# Altium schematic sheet connectors_org.SchDoc: foxBMS BMS-Slave 12-Cell
size A3; DocumentNumber: 6; SheetNumber: 6; SheetTotal: 11; AUTHOR: Fraunhofer IISB foxBMS Team; SheetDescription: Connectors
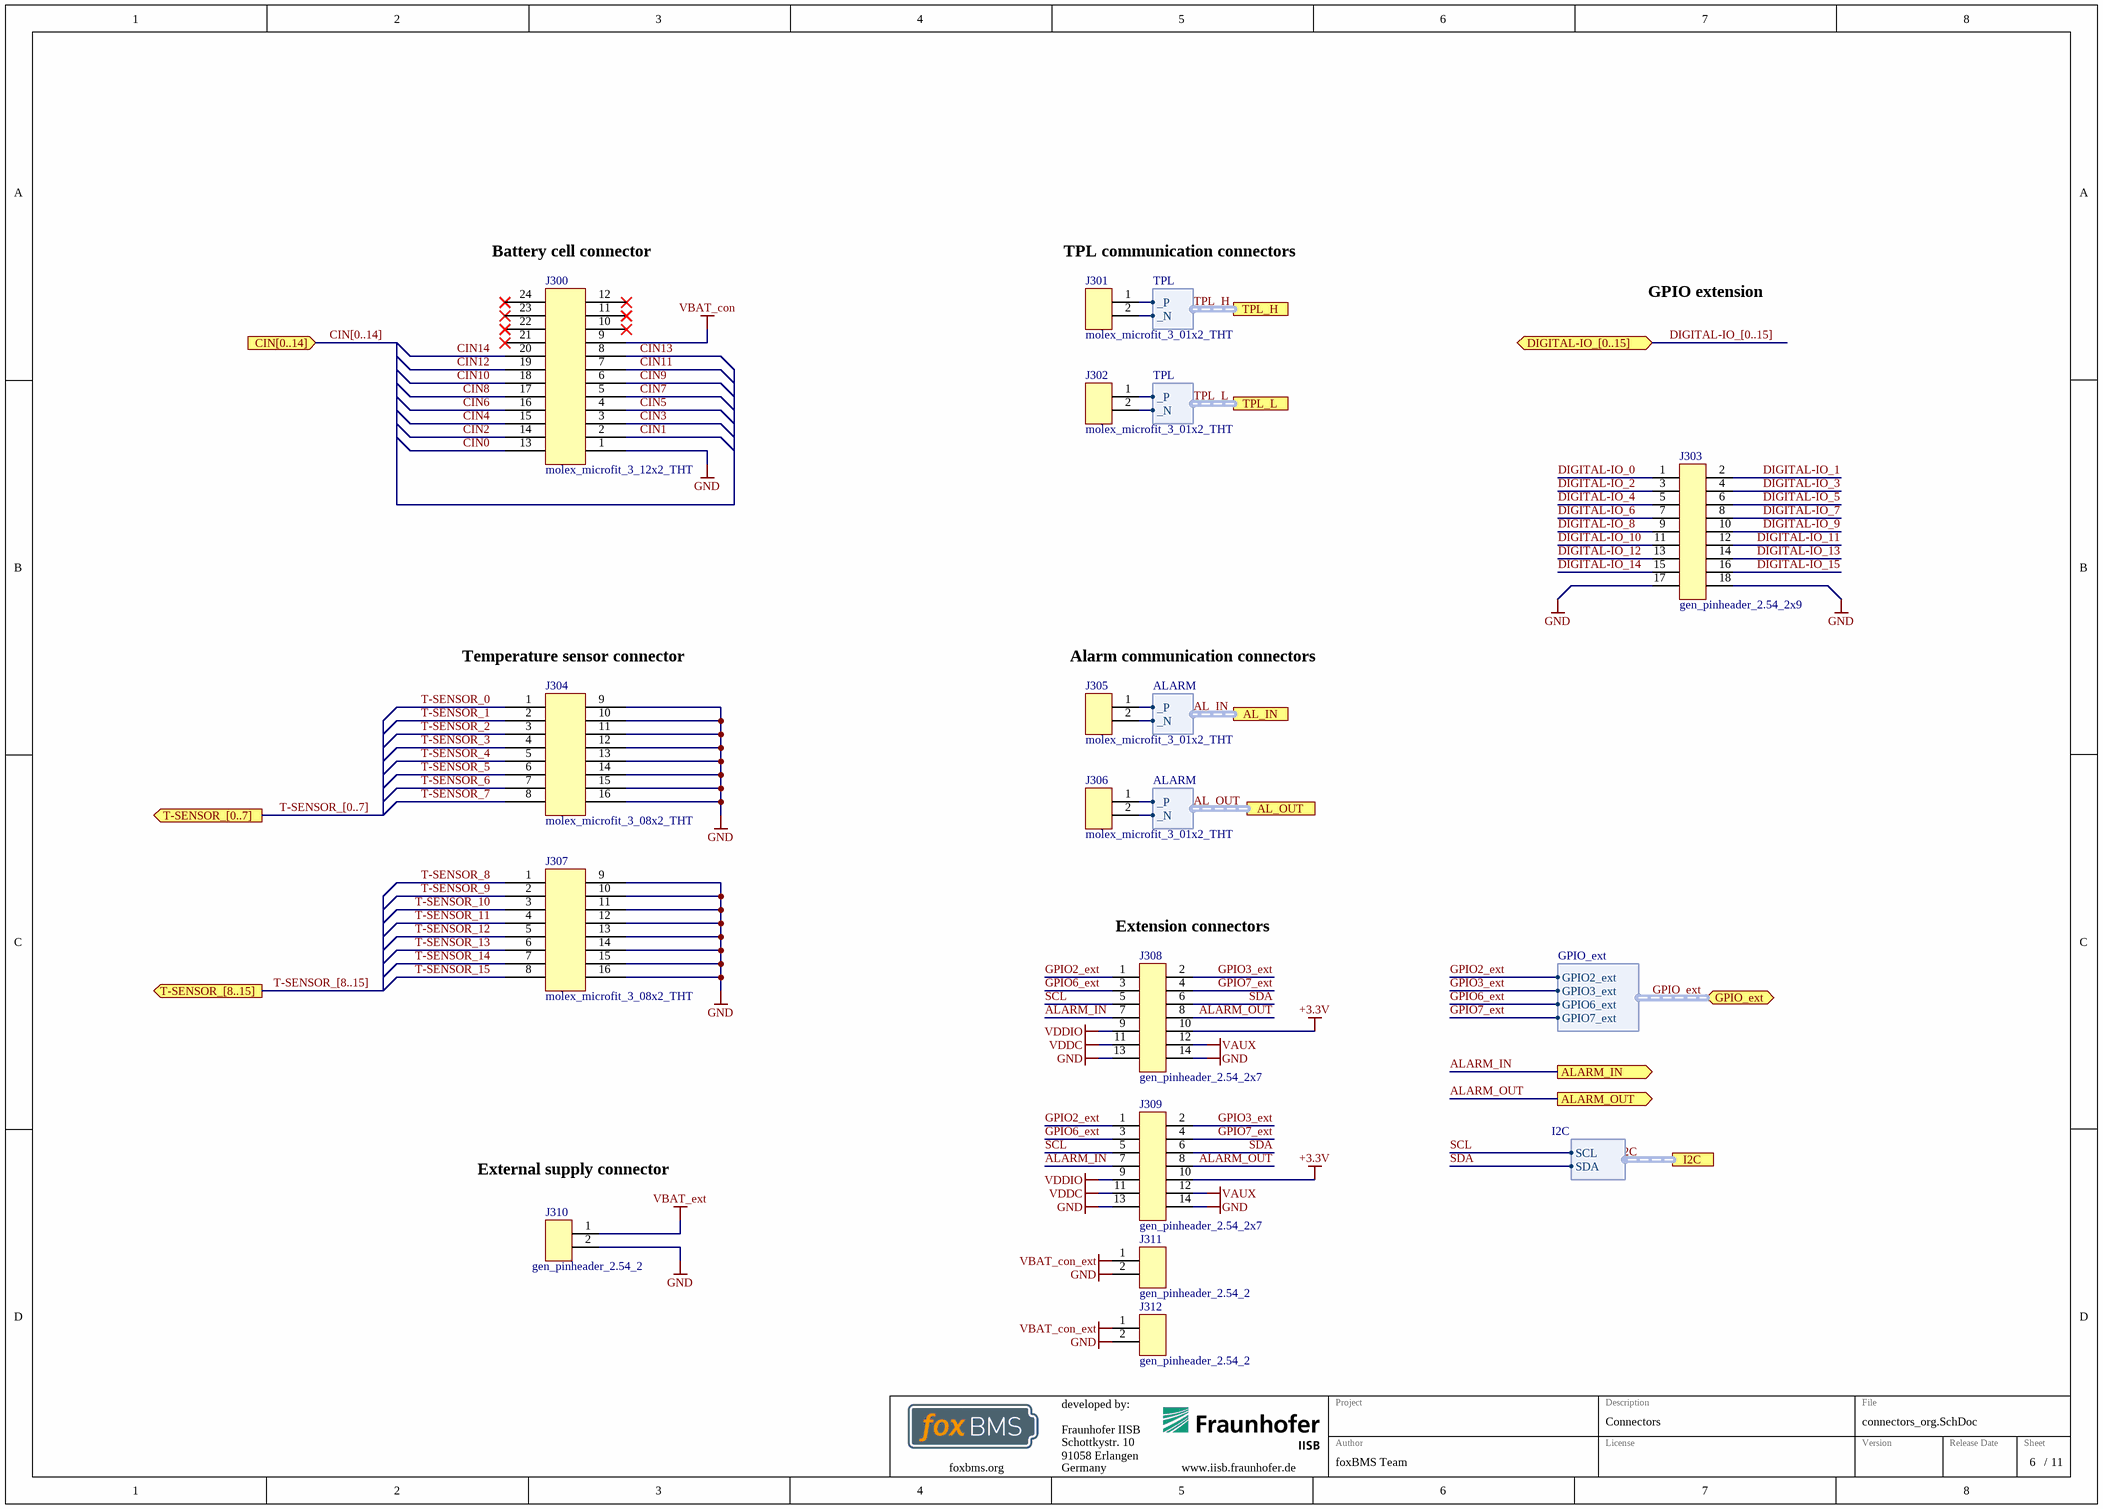
[diagram p0: connectors_org.SchDoc]

## Parts
J300  molex_microfit_3_12x2_THT  [MOLEX_MICROFIT_12x2_THT]
J301  molex_microfit_3_01x2_THT  [MOLEX_MICROFIT_01x2_THT]
J302  molex_microfit_3_01x2_THT  [MOLEX_MICROFIT_01x2_THT]
J303  gen_pinheader_2.54_2x9  [Pinheader_2.54_2x9]
J304  molex_microfit_3_08x2_THT  [MOLEX_MICROFIT_08x2_THT]
J305  molex_microfit_3_01x2_THT  [MOLEX_MICROFIT_01x2_THT]
J306  molex_microfit_3_01x2_THT  [MOLEX_MICROFIT_01x2_THT]
J307  molex_microfit_3_08x2_THT  [MOLEX_MICROFIT_08x2_THT]
J308  gen_pinheader_2.54_2x7  [Pinheader_2.54_2x7]
J309  gen_pinheader_2.54_2x7  [Pinheader_2.54_2x7]
J310  gen_pinheader_2.54_2  [Pinheader_2.54_2]
J311  gen_pinheader_2.54_2  [Pinheader_2.54_2]
J312  gen_pinheader_2.54_2  [Pinheader_2.54_2]

## Ports
AL_IN (harness ALARM), AL_OUT (harness ALARM), ALARM_IN (out), ALARM_OUT (out), CIN[0..14] (in), DIGITAL-IO_[0..15] (bidir), GPIO_ext (bidir, harness GPIO_ext), I2C (harness I2C), T-SENSOR_[0..7] (out), T-SENSOR_[8..15] (out), TPL_H (harness TPL), TPL_L (harness TPL)

## Harnesses
TPL: _P, _N
ALARM: _P, _N
GPIO_ext: GPIO3_ext, GPIO2_ext, GPIO6_ext, GPIO7_ext
I2C: SCL, SDA

## Nets
+3.3V: J308.10 J309.10
GND: J300.1 J303.17 J303.18 J304.9 J304.10 J304.11 J304.12 J304.13 J304.14 J304.15 J304.16 J307.9 J307.10 J307.11 J307.12 J307.13 J307.14 J307.15 J307.16 J308.13 J308.14 J309.13 J309.14 J310.2 J311.2 J312.2
VAUX: J308.12 J309.12
VBAT_con: J300.9
VBAT_con_ext: J311.1 J312.1
VBAT_ext: J310.1
VDDC: J308.11 J309.11
VDDIO: J308.9 J309.9
AL_IN._N: J305.2 ; port AL_IN._N
AL_IN._P: J305.1 ; port AL_IN._P
AL_OUT._N: J306.2 ; port AL_OUT._N
AL_OUT._P: J306.1 ; port AL_OUT._P
ALARM_IN: J308.7 J309.7 ; port ALARM_IN
ALARM_OUT: J308.8 J309.8 ; port ALARM_OUT
CIN0: J300.13
CIN1: J300.2
CIN2: J300.14
CIN3: J300.3
CIN4: J300.15
CIN5: J300.4
CIN6: J300.16
CIN7: J300.5
CIN8: J300.17
CIN9: J300.6
CIN10: J300.18
CIN11: J300.7
CIN12: J300.19
CIN13: J300.8
CIN14: J300.20
DIGITAL-IO_0: J303.1
DIGITAL-IO_1: J303.2
DIGITAL-IO_2: J303.3
DIGITAL-IO_3: J303.4
DIGITAL-IO_4: J303.5
DIGITAL-IO_5: J303.6
DIGITAL-IO_6: J303.7
DIGITAL-IO_7: J303.8
DIGITAL-IO_8: J303.9
DIGITAL-IO_9: J303.10
DIGITAL-IO_10: J303.11
DIGITAL-IO_11: J303.12
DIGITAL-IO_12: J303.13
DIGITAL-IO_13: J303.14
DIGITAL-IO_14: J303.15
DIGITAL-IO_15: J303.16
GPIO2_ext: J308.1 J309.1 ; port GPIO_ext.GPIO2_ext
GPIO3_ext: J308.2 J309.2 ; port GPIO_ext.GPIO3_ext
GPIO6_ext: J308.3 J309.3 ; port GPIO_ext.GPIO6_ext
GPIO7_ext: J308.4 J309.4 ; port GPIO_ext.GPIO7_ext
SCL: J308.5 J309.5 ; port I2C.SCL  [project net I2C.SCL]
SDA: J308.6 J309.6 ; port I2C.SDA  [project net I2C.SDA]
T-SENSOR_0: J304.1
T-SENSOR_1: J304.2
T-SENSOR_2: J304.3
T-SENSOR_3: J304.4
T-SENSOR_4: J304.5
T-SENSOR_5: J304.6
T-SENSOR_6: J304.7
T-SENSOR_7: J304.8
T-SENSOR_8: J307.1
T-SENSOR_9: J307.2
T-SENSOR_10: J307.3
T-SENSOR_11: J307.4
T-SENSOR_12: J307.5
T-SENSOR_13: J307.6
T-SENSOR_14: J307.7
T-SENSOR_15: J307.8
TPL_H._N: J301.2 ; port TPL_H._N
TPL_H._P: J301.1 ; port TPL_H._P
TPL_L._N: J302.2 ; port TPL_L._N
TPL_L._P: J302.1 ; port TPL_L._P

Not connected (* = marked no-connect by the designer): J300 10* 11* 12* 21* 22* 23* 24*

## Buses and harness runs
bus CIN[0..14] = port CIN[0..14]
bus DIGITAL-IO_[0..15] = port DIGITAL-IO_[0..15]
bus T-SENSOR_[0..7] = port T-SENSOR_[0..7]
bus T-SENSOR_[8..15] = port T-SENSOR_[8..15]
harness AL_IN = port AL_IN
harness AL_OUT = port AL_OUT
harness GPIO_ext = port GPIO_ext
harness I2C = port I2C
harness TPL_H = port TPL_H
harness TPL_L = port TPL_L

## Notes on the sheet
- (near J300) Battery cell connector
- (near J301) TPL communication connectors
- GPIO extension
- (near J304) Temperature sensor connector
- (near J305) Alarm communication connectors
- (near J308) Extension connectors
- External supply connector
- Fraunhofer IISB
- Schottkystr. 10
- developed by:
- 91058 Erlangen
- Germany
- Author
- Project
- License
- Description
- File
- Version
- Release Date
- Sheet
- foxbms.org <https://foxbms.org>
- www.iisb.fraunhofer.de <https://www.iisb.fraunhofer.de/>
- foxBMS Team
- /

## Library data of the parts
J300 = molex_microfit_3_12x2_THT: Micro-Fit 3.0 Right Angle Header, 3.00mm Pitch, Dual Row, 24 Circuits, with Snap-in Plastic Peg PCB Lock, Tin, Glow Wire Capable, Black, 43045-2400; Manufacturer: Molex; Circuits: 24; Rated Voltage: 600V; Rated Current: 8.5A; Automotive Qualified: False; Part Number: molex_microfit_3_12x2_THT; Part Name: MicroFit; Operating Temperature: -40°C - +105°C; Supplier 1: Farnell; Supplier Part Number 1: 1012245; ECCN: EAR99
J301 J302 J305 J306 = molex_microfit_3_01x2_THT: Micro-Fit 3.0 Right Angle Header, 3.00mm Pitch, Dual Row, 2 Circuits, with Snap-in Plastic Peg PCB Lock, Tin, Glow Wire Capable, Black, 43045-0200; Manufacturer: Molex; Circuits: 2; Rated Voltage: 600V; Rated Current: 8.5A; Automotive Qualified: False; Part Number: molex_microfit_3_01x2_THT; Part Name: MicroFit; Operating Temperature: -40°C - +105°C; Supplier 1: Farnell; Supplier Part Number 1: 1012251; ECCN: EAR99
J303 = gen_pinheader_2.54_2x9: Standard Pinheader, THD, gerade, 2.54mm, 2-reihig; Circuits: 18; Rated Voltage: 250V; Rated Current: 3A; Automotive Qualified: False; Part Number: gen_pinheader_2.54_2x9; Part Name: PinHeader; Operating Temperature: −40 °C - +105 °C; Supplier 1: Farnell; Supplier Part Number 1: 2025256
J304 J307 = molex_microfit_3_08x2_THT: Micro-Fit 3.0 Right Angle Header, 3.00mm Pitch, Dual Row, 16 Circuits, with Snap-in Plastic Peg PCB Lock, Tin, Glow Wire Capable, Black, 43045-1600; Manufacturer: Molex; Circuits: 16; Rated Voltage: 600V; Rated Current: 8.5A; Automotive Qualified: False; Part Number: molex_microfit_3_08x2_THT; Part Name: MicroFit; Operating Temperature: -40°C - +105°C; Supplier 1: Farnell; Supplier Part Number 1: 9961380; ECCN: EAR99
J308 J309 = gen_pinheader_2.54_2x7: Standard Pinheader, THD, gerade, 2.54mm, 2-reihig; Circuits: 14; Rated Voltage: 250V; Rated Current: 3A; Automotive Qualified: False; Part Number: gen_pinheader_2.54_2x7; Part Name: PinHeader; Operating Temperature: −40 °C - +105 °C; Supplier 1: Mouser; Supplier Part Number 1: 200-TSW10707GD
J310-J312 = gen_pinheader_2.54_2: Standard Pinheader, THD, gerade, 2.54mm; Circuits: 2; Rated Voltage: 250V; Rated Current: 3A; Automotive Qualified: False; Part Number: gen_pinheader_2.54_2; Part Name: PinHeader; Operating Temperature: −40 °C - +105 °C; Supplier 1: Farnell; Supplier Part Number 1: 2505044